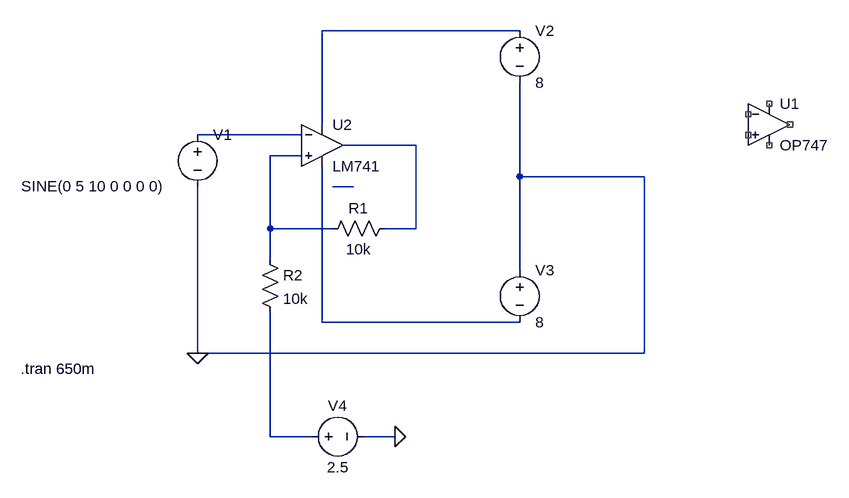
[diagram p0: schematic Vref=2.5V.asc]
Vref=2.5V.asc, the LTspice schematic file:
Version 4.1
SHEET 1 880 680
WIRE 336 -144 32 -144
WIRE 32 0 32 -144
WIRE 0 16 -160 16
WIRE 176 32 64 32
WIRE 0 48 -48 48
WIRE 336 80 336 -64
WIRE 528 80 336 80
WIRE 80 96 48 96
WIRE -48 160 -48 48
WIRE 48 160 -48 160
WIRE 176 160 176 32
WIRE 176 160 128 160
WIRE -48 208 -48 160
WIRE 336 224 336 80
WIRE 32 304 32 64
WIRE 336 304 32 304
WIRE -160 352 -160 96
WIRE 528 352 528 80
WIRE 528 352 -160 352
WIRE -48 480 -48 288
WIRE 16 480 -48 480
WIRE 144 480 96 480
FLAG -160 352 0
FLAG 144 480 0
SYMBOL OpAmps\\OP747 720 -64 R0
SYMATTR InstName U1
SYMBOL voltage -160 0 R0
WINDOW 3 -271 95 Left 2
WINDOW 123 0 0 Left 0
WINDOW 39 0 0 Left 0
SYMATTR InstName V1
SYMATTR Value SINE(0 5 10 0 0 0 0)
SYMBOL res 144 144 R90
WINDOW 0 0 56 VBottom 2
WINDOW 3 32 56 VTop 2
SYMATTR InstName R1
SYMATTR Value 10k
SYMBOL res -64 192 R0
SYMATTR InstName R2
SYMATTR Value 10k
SYMBOL voltage 336 -160 R0
WINDOW 123 0 0 Left 0
WINDOW 39 0 0 Left 0
SYMATTR InstName V2
SYMATTR Value 8
SYMBOL voltage 336 208 R0
WINDOW 123 0 0 Left 0
WINDOW 39 0 0 Left 0
SYMATTR InstName V3
SYMATTR Value 8
SYMBOL voltage 0 480 M90
WINDOW 0 -32 56 VBottom 2
WINDOW 3 32 56 VTop 2
WINDOW 123 0 0 Left 0
WINDOW 39 0 0 Left 0
SYMATTR InstName V4
SYMATTR Value 2.5
SYMBOL OpAmps\\LM741 32 -32 R0
SYMATTR InstName U2
TEXT -432 376 Left 2 !.tran 650m

The netlist it stands for:
* Vref=2.5V.asc
X§U1 NC_01 NC_02 NC_03 NC_04 NC_05 OP747  ; pins In+ In- V+ V- OUT
V1 N002 0 SINE(0 5 10 0 0 0 0)
R1 N003 N004 10k
R2 N004 N007 10k
V2 N001 0 8
V3 0 N006 8
V4 N007 0 2.5
X§U2 N004 N002 N001 N006 N003 LM741  ; pins In+ In- V+ V- OUT
.tran 650m
.lib LM741.lib
.backanno
.end